# EAGLE design HASP_relay (EAGLE 8.7.0)
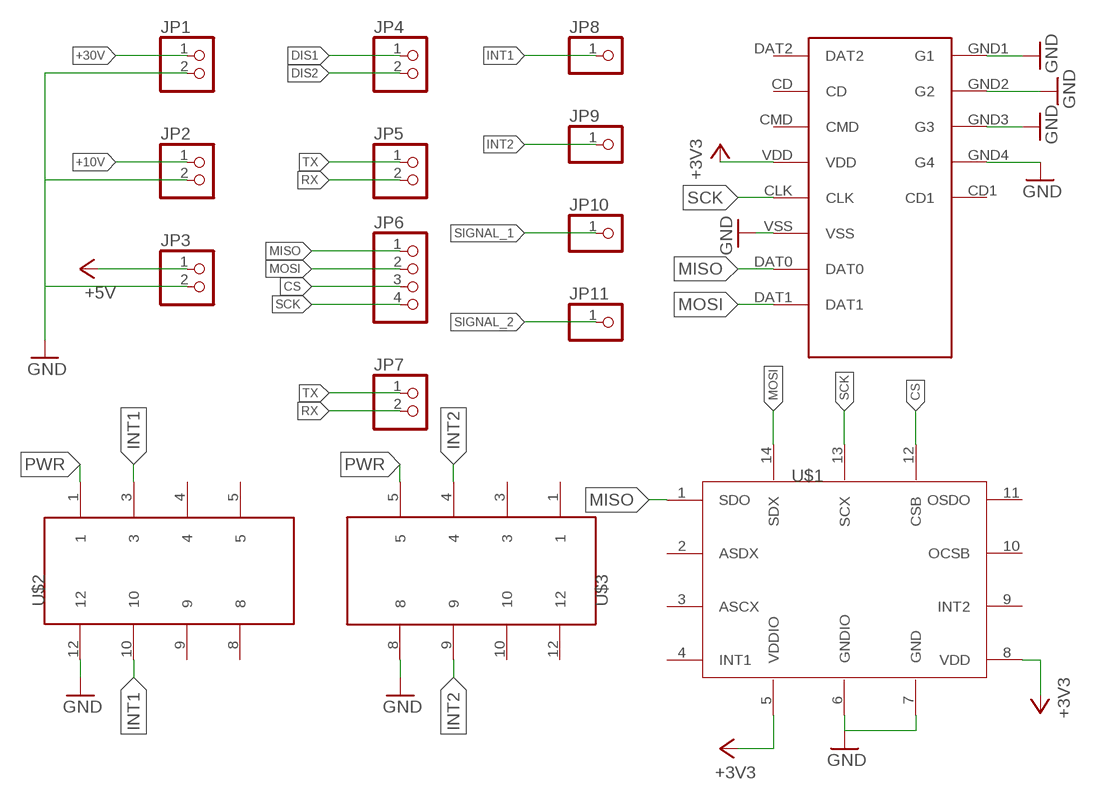
[diagram p0: schematic, sheet 1]

## Parts
JP1  PINHD-1X2  [1X02]
JP2  PINHD-1X2  [1X02]
JP3  PINHD-1X2  [1X02]
JP4  PINHD-1X2  [1X02]
JP5  PINHD-1X2  [1X02]
JP6  PINHD-1X4  [1X04]
JP7  PINHD-1X2  [1X02]
JP8  PINHD-1X1  [1X01]
JP9  PINHD-1X1  [1X01]
JP10  PINHD-1X1  [1X01]
JP11  PINHD-1X1  [1X01]
U$1  BMI160  [IMU]
U$2  EC2  [EC2-5SNU]
U$3  EC2  [EC2-5SNU]
U$4  MICRO_SD  [MICRO_SD_HINGED]

## Nets
+3V3: U$1.8(VDD) U$4.VDD
+5V: JP3.1
+10V: JP2.1
+30V: JP1.1
CS: JP6.3 U$1.12(CSB)
DIS1: JP4.1
DIS2: JP4.2
GND: JP1.2 JP2.2 JP3.2 U$1.6(GNDIO) U$1.7(GND) U$2.12 U$3.8 U$4.GND1(G1) U$4.GND2(G2) U$4.GND3(G3) U$4.GND4(G4) U$4.VSS
INT1: JP8.1 U$2.3 U$2.10
INT2: JP9.1 U$3.4 U$3.9
MISO: JP6.1 U$1.1(SDO) U$4.DAT0
MOSI: JP6.2 U$1.14(SDX) U$4.DAT1
PWR: U$2.1 U$3.5
RX: JP5.2 JP7.2
SCK: JP6.4 U$1.13(SCX) U$4.CLK
SIGNAL_1: JP10.1
SIGNAL_2: JP11.1
TX: JP5.1 JP7.1
VDDIO: U$1.5(VDDIO) ; supply symbol labelled +3V3
Unconnected: U$1.2(ASDX) U$1.3(ASCX) U$1.4(INT1) U$1.9(INT2) U$1.10(OCSB) U$1.11(OSDO) U$2.4 U$2.5 U$2.8 U$2.9 U$3.1 U$3.3 U$3.10 U$3.12 U$4.CD U$4.CD1 U$4.CMD U$4.DAT2

## Library data of the parts
JP1-JP5 JP7 = pinhead:PINHD-1X2: PIN HEADER
JP6 = pinhead:PINHD-1X4: PIN HEADER
JP8-JP11 = pinhead:PINHD-1X1: PIN HEADER
U$1 = IMU:BMI160
U$2 U$3 = relay board:EC2: EC2 is miniature signal relay Minimal board space is consumed with either a through-hole or surface mount configuration. Datasheet https://content.kemet.com/datasheets/KEM_R7002_EC2_EE2.pdf
U$4 = NR_connectors:MICRO_SD

## Board
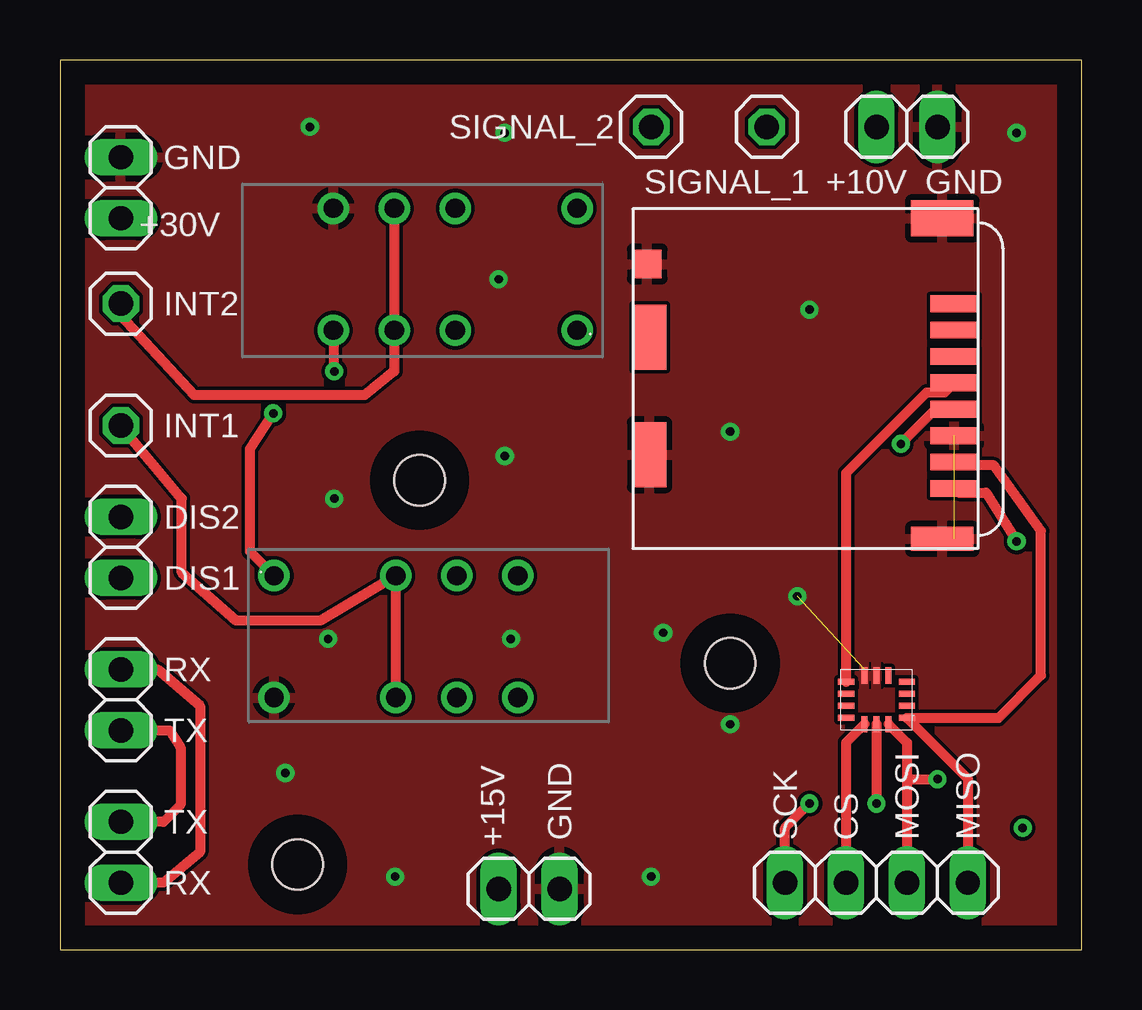
[diagram p1: board, top side]
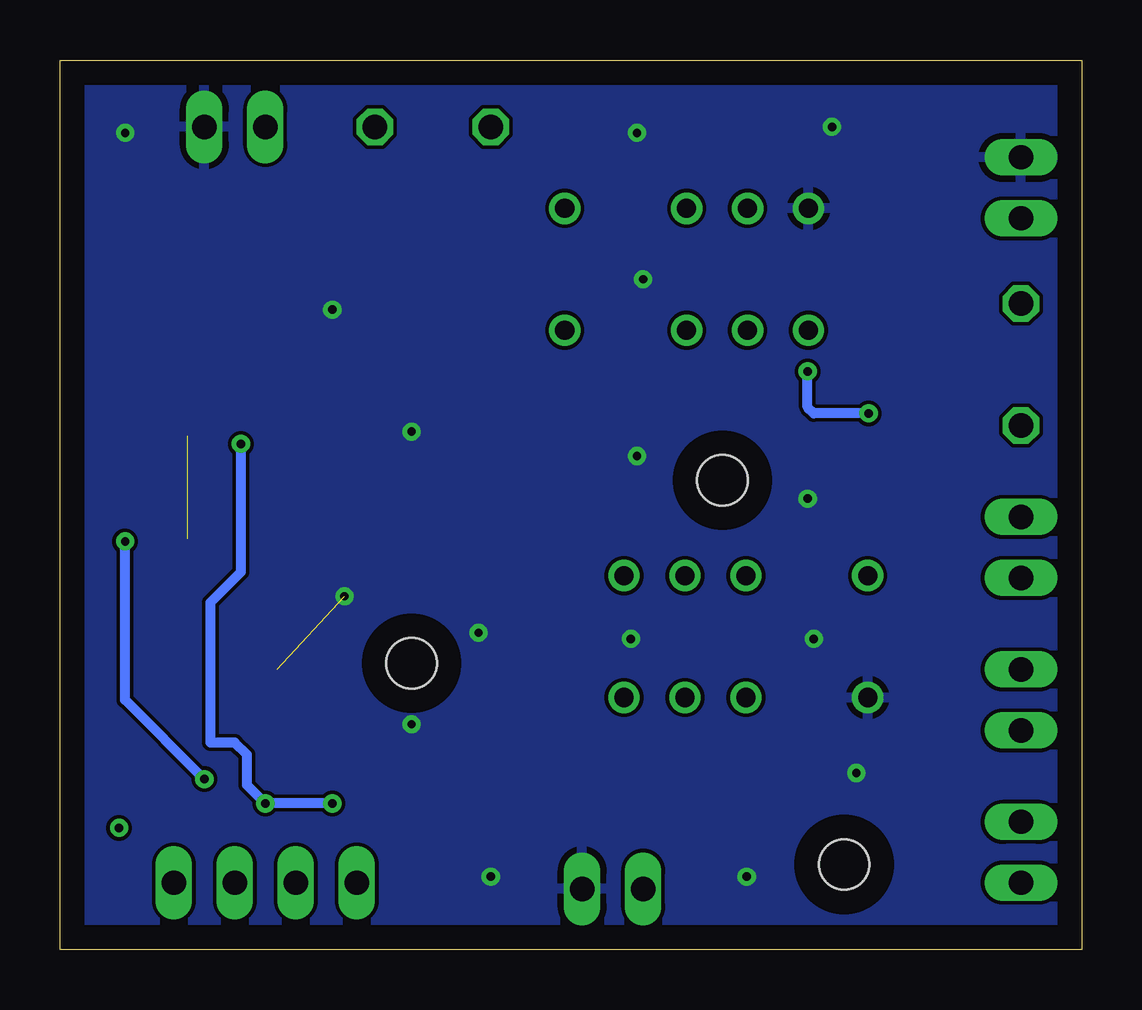
[diagram p2: board, bottom side, seen from below]

Size 42.6 x 37.07 mm. Coordinates in mm from the lower left corner, seen from the top.
Outline: 0,0 42.6,0 42.6,37.07 0,37.07 0,0
Copper layers (1*16): Top 0.035mm / dielectric 1.5mm / Bottom 0.035mm
Design rules "default": minimum track width 6mil, minimum drill 0.35mm, track to track 6mil, track to pad 6mil, pad to pad 6mil, via to via 6mil, smd to smd 6mil, copper to edge 40mil, drill to drill 6mil, minimum pad ring 10mil, minimum via ring 8mil, stop-mask expansion 4mil, vias tented up to drill 0mil, thermal gap 10mil
Holes 2.1 mm at 9.91,3.56 14.99,19.56 27.94,11.94

### Footprints (pad centres in the part's own frame; a part is rotated, then mirrored left to right if it is on the bottom)
1X02 = drill 1.016 long: 1 -1.27,0; 2 1.27,0
1X04 = drill 1.016 long: 1 -3.81,0; 2 -1.27,0; 3 1.27,0; 4 3.81,0
1X01 = drill 1.016 octagon: 1 0,0
IMU = smd 0.675 x 0.25: 1 -1.262,0.75; 2 -1.262,0.25; 3 -1.262,-0.25; 4 -1.262,-0.75; 8 1.262,-0.75; 9 1.262,-0.25; 10 1.262,0.25; 11 1.262,0.75 | smd 0.25 x 0.675: 5 -0.5,-1.012; 6 0,-1.012; 7 0.5,-1.012; 12 0.5,1.012; 13 0,1.012; 14 -0.5,1.012
EC2-5SNU = drill 0.8: 1 1.05,6.19; 3 6.13,6.19; 4 8.67,6.19; 5 11.21,6.19; 8 11.21,1.11; 9 8.67,1.11; 10 6.13,1.11; 12 1.05,1.11
MICRO_SD_HINGED = smd 0.7 x 2: CD -1.1,-13.4; CLK -4.4,-13.4; CMD -2.2,-13.4; DAT0 -6.6,-13.4; DAT1 -7.7,-13.4; DAT2 0,-13.4; VDD -3.3,-13.4; VSS -5.5,-13.4 | smd 2.7 x 1.4: CD1 -1.4,-0.7; GND3 -6.3,-0.7 | smd 1.5 x 2.6: GND1 3.55,-12.9 | smd 1.2 x 1.2: GND2 1.65,-0.6 | smd 1 x 2.6: GND4 -9.8,-12.9

### Placement (x,y rotation side)
JP1  2.54,31.75 90 top
JP2  35.31,34.29 0 top
JP3  19.56,2.54 0 top
JP4  2.54,16.76 90 top
JP5  2.54,10.41 90 top
JP6  34.04,2.79 180 top
JP7  2.54,4.06 270 top
JP8  2.54,21.84 0 top
JP9  2.54,26.92 0 top
JP10  29.46,34.29 0 top
JP11  24.64,34.29 0 top
U$1  34.04,10.41 180 top
U$2  7.87,9.4 0 top
U$3  22.61,32 180 top
U$4  23.88,26.92 90 top

### Tracks (layer width: path | path; a pad name or v marks a point on that pad's centre or on a via)
+3V3
  Top 0.406: U$4.VDD 36.88,23.23 36.13,23.23 32.77,19.87 U$1.8
CS
  Top 0.406: U$1.12 32.77,8.63 JP6.3
GND  (via drill 0.35)  (2 unrouted)
  Top 0.152: 36.58,30.47 U$4.GND1 | U$4.GND2 24.48,28.19 | U$4.GND3 24.58,20.57 | 37.28,17.12 U$4.GND4 | U$1.7 33.54,11.68
  other vias: 10.41,34.29 18.29,27.94 18.54,34.04 11.43,18.8 18.54,20.57 11.18,12.95 18.8,12.95 9.4,7.37 13.97,3.05 24.64,3.05 27.94,9.4 25.15,13.21 30.73,14.73 27.94,21.59 31.24,26.67 39.88,34.04
  pour Top: -0.51,38.35 -0.25,-0.76 44.2,-0.51 44.7,38.61
  pour Bottom: 43.18,-1.52 43.18,37.59 -1.52,37.59 -1.52,-1.52
INT1
  Top 0.406: U$2.10 U$2.3 10.86,13.72 7.34,13.72 5.08,15.72 5.08,18.8 JP8.1
INT2
  Top 0.406: U$3.9 U$3.4 13.94,24.1 12.7,23.11 5.59,23.11 2.54,26.42 JP9.1
MISO
  Top 0.406: JP6.1 37.85,7.12 U$1.1 39.13,9.66 40.89,11.43 40.89,17.46 38.93,20.18 37.42,20.18 U$4.DAT0
MOSI  (via drill 0.35)
  Top 0.406: U$1.14 35.31,8.63 35.31,7.11 | 35.31,7.11 JP6.2 | 37.67,19.22 U$4.DAT1 37.45,19.05 38.61,19.05 v39.88,17.02 | 35.31,7.11 v36.58,7.11
  Bottom 0.406: v36.58,7.11 39.88,10.41 v39.88,17.02
N$1  (via drill 0.35)
  other vias: 40.13,5.08
PWR  (via drill 0.35)
  Top 0.406: v8.89,22.35 7.91,20.86 7.91,16.6 U$2.1 | v11.43,24.1 11.43,25.78 U$3.5
  Bottom 0.406: v8.89,22.35 11.18,22.35 11.43,22.61 v11.43,24.1 11.43,24.13
RX
  Top 0.406: JP5.2 4.06,11.68 5.84,10.16 5.84,4.06 4.32,2.79 JP7.2
SCK  (via drill 0.35)
  Top 0.406: JP6.4 30.23,5.08 v31.24,6.1 | U$1.13 v34.04,6.1 | v35.05,21.08 36.49,22.52 U$4.CLK
  Bottom 0.406: v31.24,6.1 v34.04,6.1 34.8,6.86 34.8,8.13 35.31,8.64 36.32,8.64 36.32,14.48 35.05,15.75 v35.05,21.08
TX
  Top 0.406: JP5.1 4.57,9.14 5.03,8.43 5.03,6.04 4.32,5.33 JP7.1

### Text on the board
tPlace: SIGNAL_2 | GND | SIGNAL_1 | +10V | GND | +30V | INT2 | INT1 | DIS2 | DIS1 | RX | TX | TX | GND | SCK | CS | MOSI | MISO | +15V | RX